# Altium schematic sheet power_schematic.SchDoc: Power circuits
size A3; Organization: Altium Limited; Address1: L3, 12a Rodborough Rd; Address2: Frenchs Forest; Address3: NSW; Address4: Australia 2086; DocumentNumber: 6; SheetNumber: 6; SheetTotal: 8
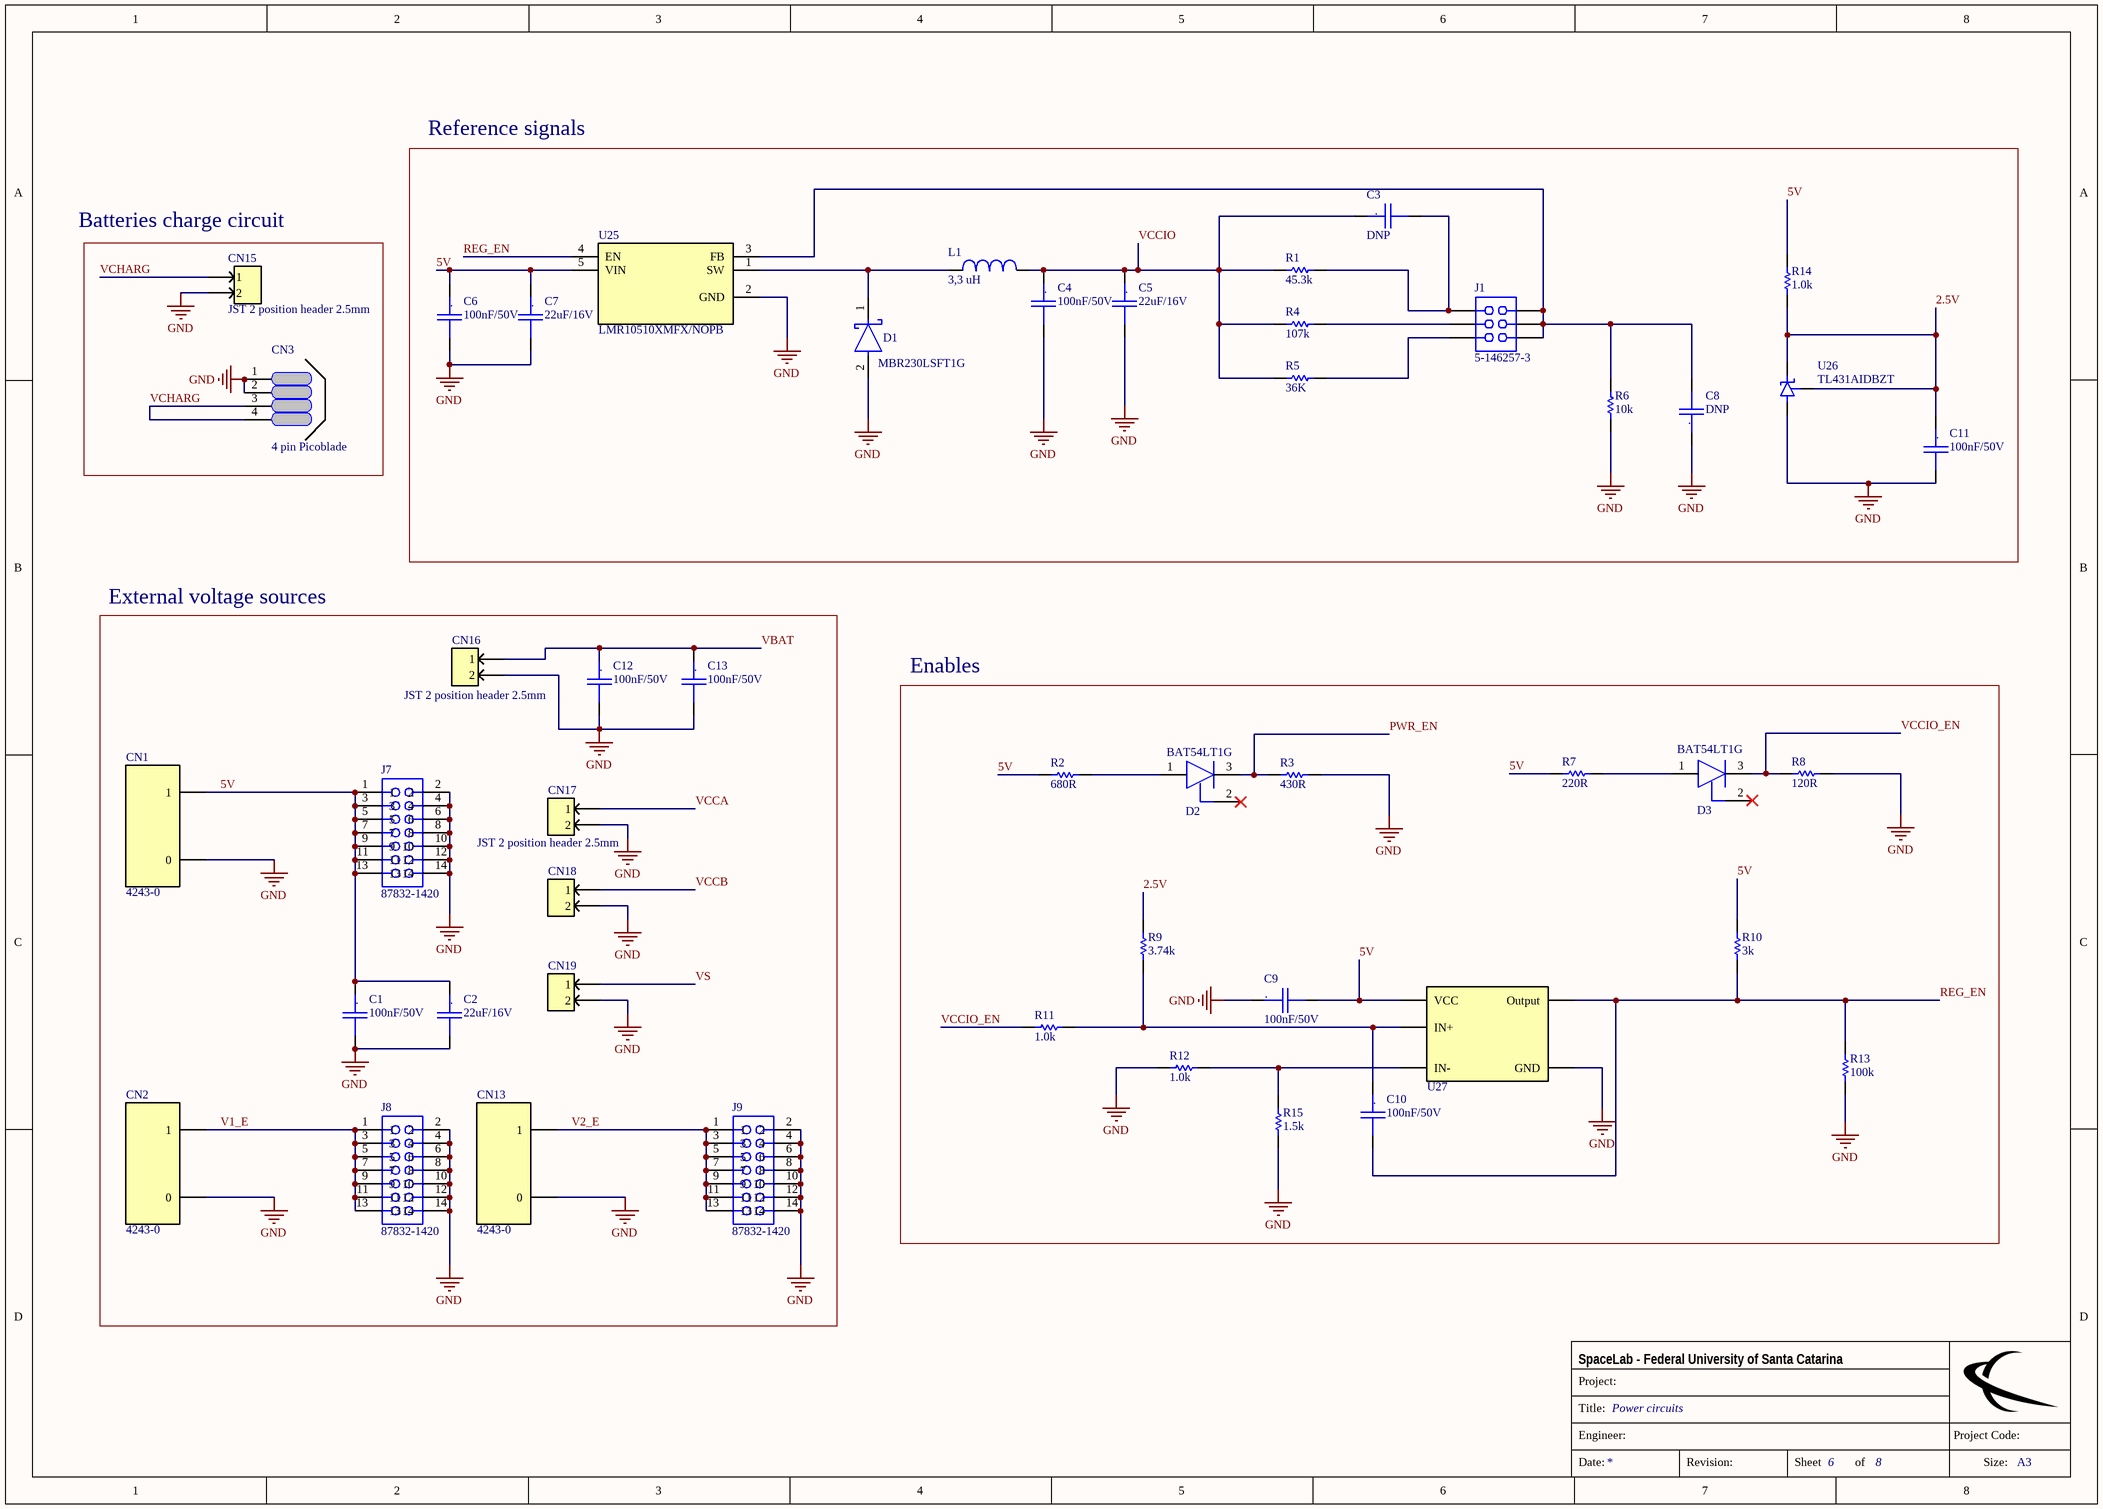
[diagram p0: power_schematic.SchDoc]

## Parts
C1  100nF/50V  [CC0603]
C2  22uF/16V  [CC1210]
C3  DNP  [CC0805]
C4  100nF/50V  [CC0603]
C5  22uF/16V  [CC1210]
C6  100nF/50V  [CC0603]
C7  22uF/16V  [CC1210]
C8  DNP  [CC0805]
C9  100nF/50V  [CC0603]
C10  100nF/50V  [CC0603]
C11  100nF/50V  [CC0603]
C12  100nF/50V  [CC0603]
C13  100nF/50V  [CC0603]
CN1  4243-0  [4243-0]
CN2  4243-0  [4243-0]
CN3  4 pin Picoblade  [PICO BLADE 0533980471]
CN13  4243-0  [4243-0]
CN15  JST 2 position header 2.5mm  [B2B-XH-A-M(LF)(SN)]
CN16  JST 2 position header 2.5mm  [B2B-XH-A-M(LF)(SN)]
CN17  JST 2 position header 2.5mm  [B2B-XH-A-M(LF)(SN)]
CN18  JST 2 position header 2.5mm  [B2B-XH-A-M(LF)(SN)]  (value not drawn)
CN19  JST 2 position header 2.5mm  [B2B-XH-A-M(LF)(SN)]  (value not drawn)
D1  MBR230LSFT1G  [On_Semiconductor_498_MFG]
D2  BAT54LT1G  [SOT95P237X112-3N]
D3  BAT54LT1G  [SOT95P237X112-3N]
J1  5-146257-3  [TE_5-146257-3]
J7  87832-1420  [SAMTEC_TSW-107-05-F-D]
J8  87832-1420  [SAMTEC_TSW-107-05-F-D]
J9  87832-1420  [SAMTEC_TSW-107-05-F-D]
L1  3,3 uH  [SRR6038]
R1  45.3k  [0805]
R2  680R  [0805]
R3  430R  [0805]
R4  107k  [0805]
R5  36K  [0805]
R6  10k  [0805]
R7  220R  [0805]
R8  120R  [0805]
R9  3.74k  [0805]
R10  3k  [0805]
R11  1.0k  [0805]
R12  1.0k  [0805]
R13  100k  [0805]
R14  1.0k  [0805]
R15  1.5k  [0805]
U25  LMR10510XMFX/NOPB  [SOT95P280X145-5N]
U26  TL431AIDBZT  [SOT95P237X112-3N]
U27  AP331AWG-7  [SOT95P280X145-5N]  (value not drawn)

## Blocks framed on the sheet
Reference signals: C3-C8 C11 D1 J1 L1 R1 R4-R6 R14 U25 U26
External voltage sources: C1 C2 C12 C13 CN1 CN2 CN13 CN16-CN19 J7-J9
Enables: C9 C10 D2 D3 R2 R3 R7-R13 R15 U27

## Nets
GND: C1.2 C2.2 C4.2 C5.2 C6.2 C7.2 C8.1 C9.1 C11.2 C12.2 C13.2 CN1.0 CN2.0 CN3.1 CN3.2 CN13.0 CN15.2 CN16.2 CN17.2 CN18.2 CN19.2 D1.2(A) J7.2 J7.4 J7.6 J7.8 J7.10 J7.12 J7.14 J8.2 J8.4 J8.6 J8.8 J8.10 J8.12 J8.14 J9.2 J9.4 J9.6 J9.8 J9.10 J9.12 J9.14 R3.1 R6.1 R8.1 R12.2 R13.1 R15.1 U25.2(GND) U26.3(ANODE) U27.2(GND)
2.5V: C11.1 R9.2 R14.1 U26.1(CATHODE) U26.2(REF)
5V: C1.1 C2.1 C6.1 C7.1 C9.2 CN1.1 J7.1 J7.3 J7.5 J7.7 J7.9 J7.11 J7.13 R2.2 R7.2 R10.2 R14.2 U25.5(VIN) U27.5(VCC)
PWR_EN: D2.3(C) R3.2
REG_EN: C10.2 R10.1 R13.2 U25.4(EN) U27.4(Output)
V1_E: CN2.1 J8.1 J8.3 J8.5 J8.7 J8.9 J8.11 J8.13
V2_E: CN13.1 J9.1 J9.3 J9.5 J9.7 J9.9 J9.11 J9.13
VBAT: C12.1 C13.1 CN16.1
VCCA: CN17.1
VCCB: CN18.1
VCCIO: C3.1 C4.1 C5.1 L1.2 R1.2 R4.2 R5.2
VCCIO_EN: D3.3(C) R8.2 R11.2
VCHARG: CN3.3 CN3.4 CN15.1
VS: CN19.1
NetC3_2: C3.2 J1.1 R1.1
NetC8_2: C8.2 J1.2 J1.4 J1.6 R6.2 U25.3(FB)
NetC10_1: C10.1 R9.1 R11.1 U27.3(IN+)
NetD1_1: D1.1(C) L1.1 U25.1(SW)
NetD2_1: D2.1(A) R2.1
NetD3_1: D3.1(A) R7.1
NetJ1_3: J1.3 R4.1
NetJ1_5: J1.5 R5.1
NetR12_1: R12.1 R15.2 U27.1(IN-)

Not connected (* = marked no-connect by the designer): D2 2(NC)*; D3 2(NC)*

## Notes on the sheet
- (near CN15) Batteries charge circuit
- Project:
- SpaceLab - Federal University of Santa Catarina
- Title:
- Engineer:
- Project Code:
- Date:
- Revision:
- Sheet
- of
- Size:
- A3
- (in symbol Cap_Cer_X7R_22uF_16V_1210) .
- (in symbol Cap_Cer_X7R_100nF_50V_0603) .
- (in symbol Cap_DNP_0805) .

## Library data of the parts
C1 C4 C6 C9-C13 = Cap_Cer_X7R_100nF_50V_0603: CAP CER 100nF 50V 10% X7R 0603; Manufacturer Part Number: C0603C104K5RAC3121; NCM: 8532.24.10
C2 C5 C7 = Cap_Cer_X7R_22uF_16V_1210: CAP CER 22uF 16V 10% X7R 1210; Manufacturer Part Number: C3225X7R1C226K250AC; NCM: 8532.24.10
C3 C8 = Cap_DNP_0805: CAP DNP 0805; NCM: 8532.24.10
CN1 CN2 CN13 = 4243-0: POMONA, 4243-0, Binding Post, 4243 Series, 15 A, 60 VDC, Tin Plated Contacts, Brass, Black; Manufacturer: Pomona Electronics; Voltage Rating: 2.5kV; Current Rating: 15A; Voltage Rating (DC): 60V; Voltage Rating (AC): 30V; Insulation: Insulated; Number of Ports: 2; Hole Diameter: 0.1inch; Panel Thickness: 6.35mm; Supplier 1: Digi-Key; Manufacturer Part Number: 4243-0; RoHS: Yes; Category: Connectors; Stock 1: 327; Pricing 1: 1=8.99000, 25=8.54040, 50=8.09100, 100=7.73150 (USD); Mount: Panel; Number of Pins: 1; Contact Plating: Tin,Bright; Contact Material: Brass; Color: Black,Red; Housing Material: Polycarbonate; Housing Color: Black; Body Material: Brass; Insulation Material: Polycarbonate; Package Quantity: 5; Packaging: Bulk; Termination: Turret; Orientation: Straight; Max Current Rating: 15A; Length: 30.23mm; Depth: 11.18mm; REACH SVHC: No SVHC; Lead Free: Lead Free; ComponentLink1URL: https://datasheet.ciiva.com/1453/d4243-1-01-1453890.pdf?src-supplier=Element14; ComponentLink1Description: https://datasheet.ciiva.com/1453/d4243-1-01-1453890.pdf?src-supplier=Element14; ComponentLink2URL: https://datasheet.ciiva.com/16883/70198115-16883751.pdf?src-supplier=Allied+Electronics; ComponentLink2Description: https://datasheet.ciiva.com/16883/70198115-16883751.pdf?src-supplier=Allied+Electronics; ComponentLink3URL: https://datasheet.ciiva.com/30105/d4243-1-02-30105753.pdf?src-supplier=Onlinecomponents.com; ComponentLink3Description: https://datasheet.ciiva.com/30105/d4243-1-02-30105753.pdf?src-supplier=Onlinecomponents.com; Supplier Part Number 1: 501-1126-ND
CN3 = 0533980471: 1.25mm Pitch PicoBlade™ Header, Surface Mount, Vertical, 4 Circuits; Manufacturer: Molex; Manufacturer Part Number: 53398-0471; N of Positions: 4; Body Plating: Tin; Gender: Male; Current Rating: 1A; Voltage Rating: 125V; Contact Resistance: 20mR; Insulation Resistance: 100MR; Glow Wire Compliant: Non-compliant; Pitch: 1.25mm; Mount Type: SMD; Value: 0533980471; Supplier 1: Digi-Key; Supplier Part Number 1: WM7608CT-ND; Stock 1: 21236; Pricing 1: 1=1.19, 10=1.044, 100=0.901, 500=0.73716 (USD); Mount: Surface Mount; Contact Plating: Tin; Contact Material: Bronze,Tin,Brass; Color: Natural; Housing Color: Natural; Housing Material: Nylon; Min Operating Temperature: -40°C; Max Operating Temperature: 85°C; Number of Rows: 1; Packaging: Tape and Reel; Number of Positions: 4; Termination: Solder; Package Quantity: 1000; Voltage Rating (AC): 125V; Number of Contacts: 4; Working Voltage: 125V; Orientation: Vertical; Number of Circuits: 4; Voltage Rating (DC): 125V; Lead Pitch: 1.25mm; Radiation Hardening: No; Flammability Rating: UL94 V-0; REACH SVHC: Unknown; Lead Free: Lead Free; ComponentLink1URL: http://www.mouser.com/ds/2/276/0533980471_PCB_HEADERS-171069.pdf?src-supplier=Mouser; ComponentLink1Description: http://www.mouser.com/ds/2/276/0533980471_PCB_HEADERS-171069.pdf?src-supplier=Mouser; ComponentLink2URL: http://www.jameco.com/Jameco/Products/ProdDS/1932627.pdf?src-supplier=Jameco; ComponentLink2Description: http://www.jameco.com/Jameco/Products/ProdDS/1932627.pdf?src-supplier=Jameco; ComponentLink3URL: https://www.distrelec.biz/Web/Downloads/46/_e/gf116833-116846_e.pdf?mime=application%2Fpdf&src-supplier=Distrelec; ComponentLink3Description: https://www.distrelec.biz/Web/Downloads/46/_e/gf116833-116846_e.pdf?mime=application%2Fpdf&src-supplier=Distrelec; ComponentLink4URL: http://www.molex.com/webdocs/datasheets/pdf/en-us/0533980471_PCB_HEADERS.pdf?src-supplier=Element14; ComponentLink4Description: http://www.molex.com/webdocs/datasheets/pdf/en-us/0533980471_PCB_HEADERS.pdf?src-supplier=Element14; ComponentLink5URL: http://www.farnell.com/datasheets/1867381.pdf?src-supplier=Element14; ComponentLink5Description: http://www.farnell.com/datasheets/1867381.pdf?src-supplier=Element14; ComponentLink6URL: http://uk.rs-online.com/webdocs/13c4/0900766b813c4500.pdf?src-supplier=RSComponents; ComponentLink6Description: http://uk.rs-online.com/webdocs/13c4/0900766b813c4500.pdf?src-supplier=RSComponents; ComponentLink7URL: http://www.molex.com/webdocs/datasheets/pdf/en-us/0533980471_PCB_HEADERS.pdf?src-supplier=Farnell; ComponentLink7Description: http://www.molex.com/webdocs/datasheets/pdf/en-us/0533980471_PCB_HEADERS.pdf?src-supplier=Farnell; ComponentLink8URL: http://www.farnell.com/datasheets/2697809.pdf?src-supplier=Element14; ComponentLink8Description: http://www.farnell.com/datasheets/2697809.pdf?src-supplier=Element14; ComponentLink9URL: http://www.molex.com/webdocs/datasheets/pdf/en-us/0533980471_PCB_HEADERS.pdf?src-supplier=Avnet; ComponentLink9Description: http://www.molex.com/webdocs/datasheets/pdf/en-us/0533980471_PCB_HEADERS.pdf?src-supplier=Avnet; ComponentLink10URL: http://www.molex.com/webdocs/datasheets/pdf/en-us/0533980471_PCB_HEADERS.pdf?src-supplier=Avnet+Europe; ComponentLink10Description: http://www.molex.com/webdocs/datasheets/pdf/en-us/0533980471_PCB_HEADERS.pdf?src-supplier=Avnet+Europe; Supplier 2: Mouser; Supplier Part Number 2: 538-53398-0471; Stock 2: 43680; Pricing 2: 1=0.98, 10=0.832, 100=0.716, 500=0.6, 1000=0.391, 2000=0.342 (USD)
CN15-CN19 = B2B-XH-A-M(LF)(SN): CONN HEADER TOP 2POS 2.5MM GRN; Number of Positions: 2; Connector Type: Male Pin; Pitch: 0.098inch; Supplier 1: Digi-Key; Supplier Part Number 1: 455-2879-ND; Manufacturer: JST; Stock 1: 5564; Pricing 1: 1=0.17, 10=0.157, 100=0.0966, 500=0.07998, 1000=0.06999, 5000=0.05999, 10000=0.05832 (USD); Mount: Through Hole; Color: Natural; Contact Plating: Tin; Packaging: Bulk; Number of Rows: 1; Termination: Press-Fit; Fastening Type: Detent; Package Quantity: 1000; Manufacturer Part Number: B2B-XH-A-M(LF)(SN); ComponentLink1Description: http://www.jst-mfg.com/product/pdf/eng/eXH.pdf; ComponentLink1URL: http://www.jst-mfg.com/product/pdf/eng/eXH.pdf
J1 = 5-146257-3: Header; Breakaway; 0.100 x 0.100 in.; PC Board; Dual; 6; 0.025 in.; 0.12 in.; Product_Type: Connector; Number_of_Positions: 6; MF: TE Connectivity; Centerline_Pitch: 2.54 mm[.1 in]; Package: None; EU_RoHS_Compliance: Compliant; DigiKey-Purchase-URL: https://snapeda.com/shop?store=DigiKey&id=338021; Value: *; Mouser-Purchase-URL: https://snapeda.com/shop?store=Mouser&id=338021; Availability: Warning; Price: None; SnapEDA_Link: https://www.snapeda.com/parts/5-146257-3/TE%20Connectivity%20AMP%20Connectors/view-part/338021/?ref=snap; Manufacturer Part Number: 5-146257-3
J7-J9 = 87832-1420: Connector Header Surface Mount 14 position 0.079 _2.00mm_; Manufacturer Part Number: TSW-107-05-F-D; MF: Molex; Value: *; SnapEDA_Link: https://www.snapeda.com/parts/87832-1420/Molex/view-part/78740/?ref=snap; Price: None; Package: None; Availability: Unavailable
L1 = 3,3 uH: 3.3ÂµH Shielded Wirewound Inductor 3.5A 20mOhm Max Nonstandard; Manufacturer Part Number: SRR6038-3R3Y; MF: Bourns; Value: *; Availability: Unavailable; Price: None; SnapEDA_Link: https://www.snapeda.com/parts/SRR6038-3R3Y/Bourns/view-part/885274/?ref=snap; Package: Nonstandard Bourns
R1 = R45.3k_1%_1/10W_0805: RES 45.3K OHM 1/8W 1% 0805; Manufacturer Part Number: RC0805FR-0745K3L; NCM: 8533.21.20
R2 = R680R_1%_1/8W_0805: RES 680R OHM 1/8W 1% 0805; Manufacturer Part Number: CRGCQ0805F680R; NCM: 8533.21.20
R3 = R430R_1%_1/4W_0805: RES 430R OHM 1/8W 0.1% 0805; Manufacturer Part Number: RT0805BRD07430RL; NCM: 8533.21.20
R4 = R107k_1%_1/8W_0805: RES 107K OHM 1/8W 1% 0805; Manufacturer Part Number: RC0805FR-07107KL; NCM: 8533.21.20
R5 = R36K_1%_1/10W_0805: RES 36K OHM 1/8W 0.1% 0805; Manufacturer Part Number: RG2012N-363-B-T5; NCM: 8533.21.20
R6 = R10k_1%_1/8W_0805: RES 10K OHM 1/8W 1%  0805; Manufacturer Part Number: CRCW080510K0FKEA; NCM: 8533.21.20
R7 = R220R_1%_1/8W_0805: RES 220R OHM 1/8W 1% 0805; Manufacturer Part Number: CRCW0805220RFKEA; NCM: 8533.21.20
R8 = R120R_1%_1/4W_0805: RES 120R OHM 1/8W 1% 0805; Manufacturer Part Number: CRGCQ0805F120R; NCM: 8533.21.20
R9 = R3.74k_1%_1/8W_0805: RES 3.74K OHM 1/8W 0.5% 0805; Manufacturer Part Number: RT0805DRE073K74L; NCM: 8533.21.20
R10 = R3.0k_1%_1/8W_0805: RES 3.0K OHM 1/10W 0.1% 0805; Manufacturer Part Number: ERA-6YEB302V; NCM: 8533.21.20
R11 R12 R14 = R1.0k_1%_1/8W_0805: RES 1.0K OHM 1/8W 1% 0805; Manufacturer Part Number: RC0805FR-071KL; NCM: 8533.21.20
R13 = R100k_1%_1/8W_0805: RES 100K OHM 1/8W 1% 0805; Manufacturer Part Number: AC0805FR-13100KL; NCM: 8533.21.20
R15 = R1.5K_1%_1/10W_0805: RES 1.5K OHM 1/10W 0.1% 0805; Manufacturer Part Number: RN73C2A1K5BTDF; NCM: 8533.21.20
U26 = TL431AIDBZT: Shunt Voltage Reference IC 36V Â±1% SOT-23-3; MF: Texas Instruments; SnapEDA_Link: https://www.snapeda.com/parts/TL431AIDBZT/Texas%20Instruments/view-part/277644/?ref=snap; Package: SOT-23-3 Texas Instruments; Price: None; Value: *; Availability: Unavailable; Manufacturer Part Number: TL431AIDBZT
D1 = MBR230LSFT1G: Manufacturer Part Number: MBR230LSFT1G
D2 D3 = BAT54LT1G: Manufacturer Part Number: BAT54LT1G
U25 = LMR10510XMFX/NOPB: Package: None; Price: None; Value: *; Availability: Unavailable; Manufacturer Part Number: LMR10510XMFX/NOPB
U27 = AP331AWG-7: Manufacturer Part Number: AP331AWG-7